# Altium project PCB_Siren.PrjPcb
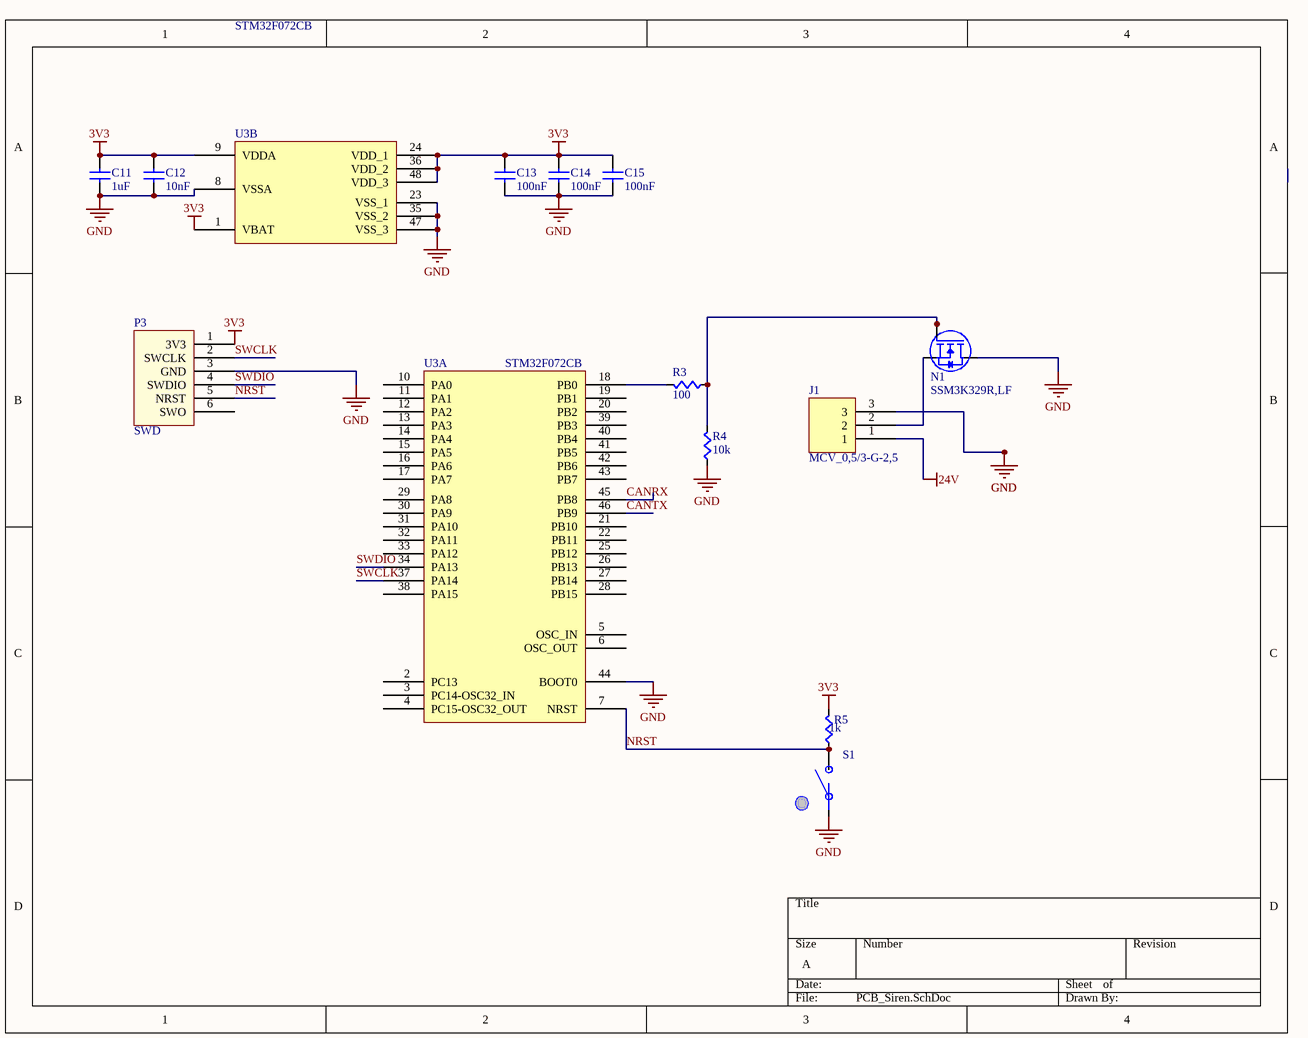
[diagram p0: PCB_Siren.SchDoc]
3 sheets, 19 parts. Net scope: global (net labels, ports and power ports of the same name join across sheets).
Board file: Siren.PcbDoc
Sheets:
  PCB_Siren.SchDoc
  5Vto3V3_Power_Connector.SchDoc
  CAN_Connections.SchDoc

## Sheet PCB_Siren.SchDoc
size A

### Parts
C11  value 1uF  [CAPC0603]  (hidden comment: Cap)
C12  value 10nF  [CAPC0603]  (hidden comment: Cap)
C13  value 100nF  [CAPC0603]  (hidden comment: Cap)
C14  value 100nF  [CAPC0603]  (hidden comment: Cap)
C15  value 100nF  [CAPC0603]  (hidden comment: Cap)
J1  MCV_0,5/3-G-2,5  [MCV_0,5/3-G-2,5]
N1  SSM3K329R,LF  [SSM3K329R,LF]
P3  SWD  [SWD_STM32]
R3  value 100  [RES0603]  (hidden comment: Res)
R4  value 10k  [RES0603]  (hidden comment: Res)
R5  value 1k  [RES0603]  (hidden comment: Res)
S1  Button  [PTS645xxxxSMTR92]  (value not drawn)
U3  STM32F072CB  [STM32F072CB]  (parts A,B of 2)

### Nets
3V3: C11.1(A) C12.1(A) C13.1(A) C14.1(A) C15.1(A) P3.1(3V3) R5.1(A) U3.1(VBAT) U3.9(VDDA) U3.24(VDD_1) U3.36(VDD_2) U3.48(VDD_3)
24V: J1.1
GND: C11.2(B) C12.2(B) C13.2(B) C14.2(B) C15.2(B) J1.3 N1.3(D) P3.3(GND) R4.2(B) S1.A U3.8(VSSA) U3.23(VSS_1) U3.35(VSS_2) U3.44(BOOT0) U3.47(VSS_3)
CANRX: U3.45(PB8)
CANTX: U3.46(PB9)
NRST: P3.5(NRST) R5.2(B) S1.B U3.7(NRST)
SWCLK: P3.2(SWCLK) U3.37(PA14)
SWDIO: P3.4(SWDIO) U3.34(PA13)
NetJ1_2: J1.2 N1.2(S)
NetN1_1: N1.1(G) R3.2(B) R4.1(A)
NetR3_1: R3.1(A) U3.18(PB0)

Not connected (* = marked no-connect by the designer): P3 6(SWO); U3 2(PC13) 3(PC14-OSC32_IN) 4(PC15-OSC32_OUT) 5(OSC_IN) 6(OSC_OUT) 10(PA0) 11(PA1) 12(PA2) 13(PA3) 14(PA4) 15(PA5) 16(PA6) 17(PA7) 19(PB1) 20(PB2) 21(PB10) 22(PB11) 25(PB12) 26(PB13) 27(PB14) 28(PB15) 29(PA8) 30(PA9) 31(PA10) 32(PA11) 33(PA12) 38(PA15) 39(PB3) 40(PB4) 41(PB5) 42(PB6) 43(PB7)

### Library data of the parts
J1 = MCV_0,5/3-G-2,5: CONN TERM BLOCK 2.50MM 3POS, Vertical, Through-Hole, 4A; Manufacturer 1: Phoenix Contact; Manufacturer Part Number 1: 1881561; Mating Connector: 277-1431-ND; Supplier 1: Digi-Key; Supplier Part Number 1: 277-1453-ND
N1 = SSM3K329R,LF: MOSFET N CH 30V 3.5A 2-3Z1A; Manufacturer 1: Toshiba Semiconductor and Storage; Supplier 1: Digi-Key; Supplier Part Number 1: SSM3K329RLFTR-ND; Manufacturer Part Number 1: SSM3K329R,LF
P3 = SWD_STM32: SWD connector matching the pinout on STM Discovery Boards
S1 = Button: SPST Button; Supplier 1: Digi-Key; Supplier Part Number 1: CKN9087CT-ND
U3 = STM32F072CB: MCU 32BIT 128KB FLASH 48LQFP; Supplier 1: Digi-Key; Supplier Part Number 1: 497-14645-ND
C11-C15 = Cap: Supplier 1: Digi-Key
  C13-C15: Supplier Part Number 1: 1276-1000-1-ND
R3-R5 = Res: Supplier 1: Digi-Key
  R3: Supplier Part Number 1: 311-100LRDKR-ND
  R4: Supplier Part Number 1: RMCF0603JT10K0CT-ND

## Sheet 5Vto3V3_Power_Connector.SchDoc
size A
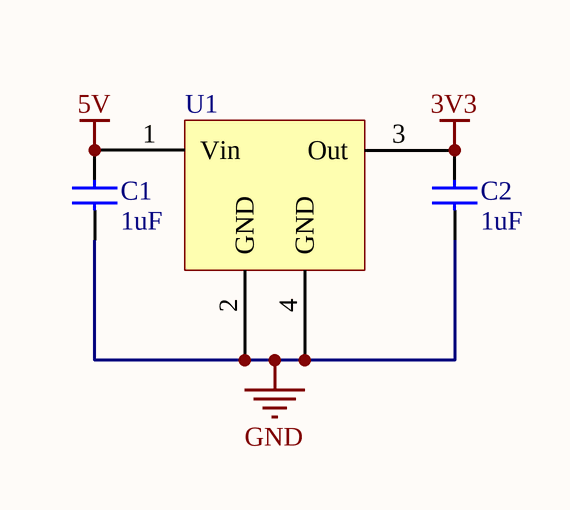
[diagram p1: 5Vto3V3_Power_Connector.SchDoc]

### Parts
C1  value 1uF  [CAPC0603]  (hidden comment: Cap)
C2  value 1uF  [CAPC0603]  (hidden comment: Cap)
U1  3.3V LDO Reg  [SOT23-4n]  (value not drawn)

### Nets
3V3: C2.1(A) U1.3(Out)
5V: C1.1(A) U1.1(Vin)
GND: C1.2(B) C2.2(B) U1.2(GND) U1.4(GND)

### Library data of the parts
U1 = LM3940IMPX-3.3: IC REG LDO 3.3V 1A SOT223; Supplier 1: Digi-Key; Supplier Part Number 1: LM3940IMPX-3.3/NOPBCT-ND
C1 C2 = Cap: Supplier 1: Digi-Key; Supplier Part Number 1: 1276-1000-1-ND

## Sheet CAN_Connections.SchDoc
size A
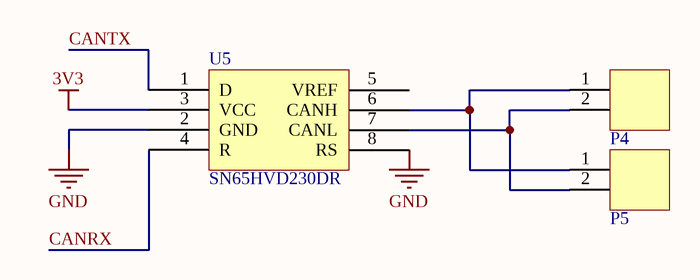
[diagram p2: CAN_Connections.SchDoc]

### Parts
P4  2-pin Horz Sherlock  [MOLEX-HDR-1X2-SHERLOCK-HORZ]  (value not drawn)
P5  2-pin Horz Sherlock  [MOLEX-HDR-1X2-SHERLOCK-HORZ]  (value not drawn)
U5  SN65HVD230DR  [SOIC-8pin]

### Nets
3V3: U5.3(VCC)
GND: U5.2(GND) U5.8(RS)
CANRX: U5.4(R)
CANTX: U5.1(D)
NetP4_1: P4.1 P5.1 U5.6(CANH)
NetP4_2: P4.2 P5.2 U5.7(CANL)

Not connected (* = marked no-connect by the designer): U5 5(VREF)

### Library data of the parts
P4 P5 = MOLEX-HDR-1x2-SHERLOCK_RA: Header, Molex, 2mm Pitch Sherlock Header, Single Row, Horizontal, 2 Circuits, Length 3.3mm,  0353630260; Manufacturer: Molex Inc; Manufacturer Part Number: 0353630260; Supplier Part Number 1: WM18931-ND; Supplier 1: Digi-Key
U5 = SN65HVD230DR: IC TXRX CAN 1MBPS 3.3V 8SOIC; Supplier 1: Digi-Key; Supplier Part Numbe 1: 296-11654-1-ND

## Nets that join several sheets
3V3: PCB_Siren (12 pins), 5Vto3V3_Power_Connector (C2.1 U1.3), CAN_Connections (U5.3)
GND: PCB_Siren (15 pins), 5Vto3V3_Power_Connector (C1.2 C2.2 U1.2 U1.4), CAN_Connections (U5.2 U5.8)
CANRX: PCB_Siren (U3.45), CAN_Connections (U5.4)
CANTX: PCB_Siren (U3.46), CAN_Connections (U5.1)